# EAGLE schematic Cmde moteurs_5 (EAGLE 6.5.0)

## Sheet 1 of 3
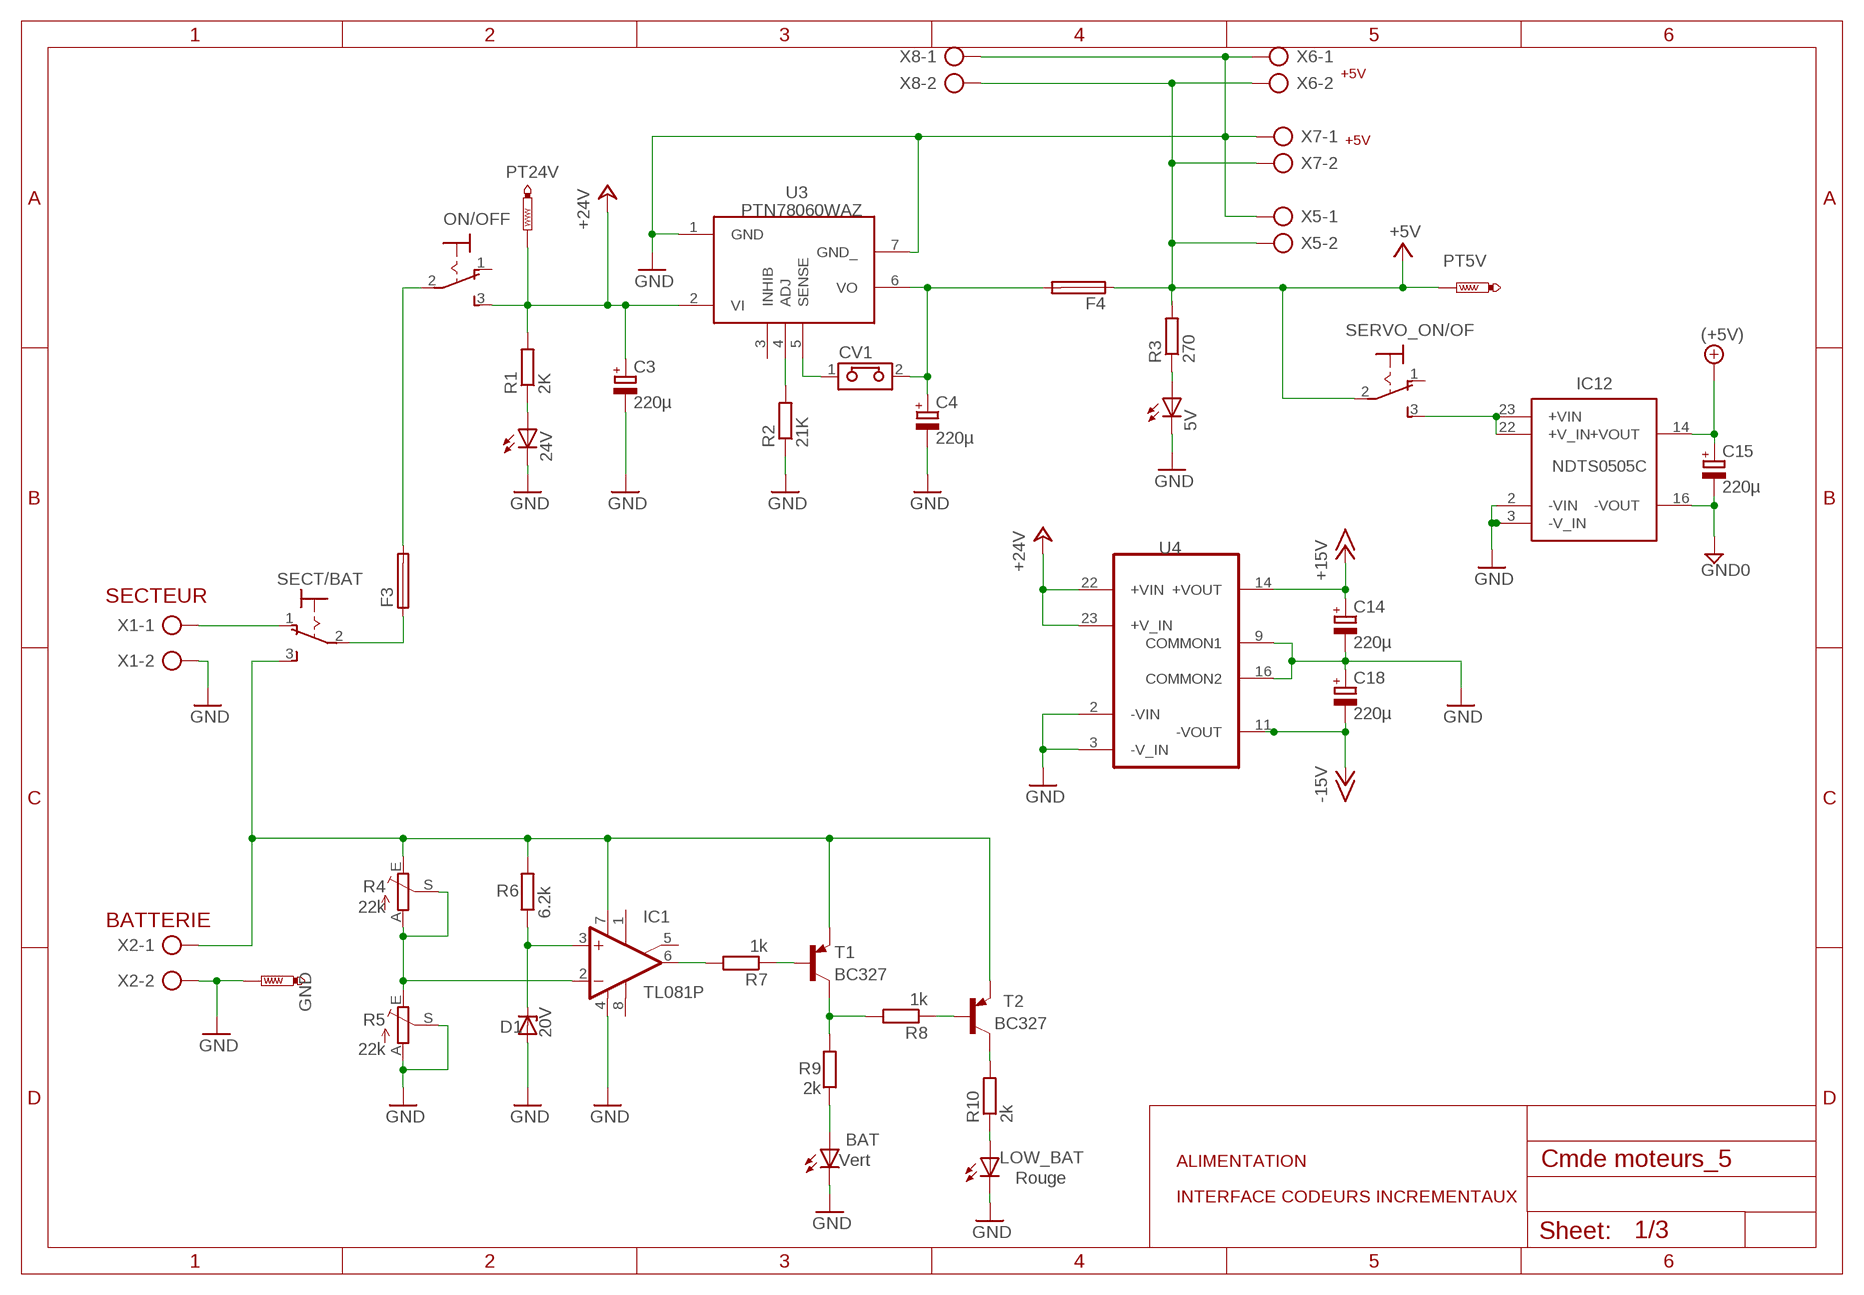
[diagram p0: schematic, sheet 1]

### Parts
5V  LED3MM  [LED3MM]
24V  LED3MM  [LED3MM]
BAT  Vert  LED3MM  [LED3MM]
C3  220µ  CPOL-EUE5-10.5  [E5-10,5]
C4  220µ  CPOL-EUE5-10.5  [E5-10,5]
C14  220µ  CPOL-EUE5-8.5  [E5-8,5]
C15  220µ  CPOL-EUE5-8.5  [E5-8,5]
C18  220µ  CPOL-EUE5-8.5  [E5-8,5]
CV1  CAVALIER  [CAVALIER]
D1  20V  BZX90  [DO34Z7]
F3  SH22,5  [SH22,5]
F4  SH22,5  [SH22,5]
GND  PTR1PAD1-13Y  [P1-13Y]
IC1  TL081P  [DIL08]
IC12  NDTS0505C  [NDTS05505]
LOW_BAT  Rouge  LED3MM  [LED3MM]
ON/OFF  320-916  [320-916]
PT5V  PTR1PAD1-13Y  [P1-13Y]
PT24V  PTR1PAD1-13Y  [P1-13Y]
R1  2K  R-EU_0207/10  [0207/10]
R2  21K  R-EU_0207/10  [0207/10]
R3  270  R-EU_0207/10  [0207/10]
R4  22k  TRIM_EU-B64Y  [B64Y]
R5  22k  TRIM_EU-B64Y  [B64Y]
R6  6.2k  R-EU_0207/10  [0207/10]
R7  1k  R-EU_0207/10  [0207/10]
R8  1k  R-EU_0207/10  [0207/10]
R9  2k  R-EU_0207/10  [0207/10]
R10  2k  R-EU_0207/10  [0207/10]
SECT/BAT  320-916  [320-916]
SERVO_ON/OF  320-916  [320-916]
T1  BC327  BC327-16-PNP-TO92-EBC  [TO92-EBC]
T2  BC327  BC327-16-PNP-TO92-EBC  [TO92-EBC]
U3  PTN78060WAD  [PTN78060]
U4  TEN8-2423  [NDTS05505]
X1  AK300/2  [AK300/2]
X2  AK300/2  [AK300/2]
X5  AK300/2  [AK300/2]
X6  AK300/2  [AK300/2]
X7  AK300/2  [AK300/2]
X8  AK300/2  [AK300/2]

### Nets
+5V: C15.+ F4.1 IC12.14(+VOUT) PT5V.TP R3.2 SERVO_ON/OF.2(P) X5.2 X6.2 X7.2 X8.2 ; supply symbol labelled (+5V) ; also sheet 2,3
+15V: C14.+ U4.14(+VOUT) ; also sheet 3
+24V: C3.+ ON/OFF.3(S) PT24V.TP R1.2 U3.2(VI) U4.22(+VIN) U4.23(+V_IN) ; also sheet 3
-15V: C18.- U4.11(-VOUT) ; also sheet 3
GND: 5V.K(C) 24V.K(C) BAT.K(C) C3.- C4.- C14.- C15.- C18.+ D1.A GND.TP IC1.4(V-) IC12.2(-VIN) IC12.3(-V_IN) IC12.16(-VOUT) LOW_BAT.K(C) R2.1 R5.A R5.S U3.1(GND) U3.7(GND_) U4.2(-VIN) U4.3(-V_IN) U4.9(COMMON1) U4.16(COMMON2) X1.2 X2.2 X5.1 X6.1 X7.1 X8.1 ; supply symbol labelled GND0 ; also sheet 2,3
N$4: IC1.7(V+) R4.E R6.2 SECT/BAT.3(S) T1.E T2.E X2.1
N$6: F3.1 SECT/BAT.2(P)
N$7: F3.2 ON/OFF.2(P)
N$9: R2.2 U3.4(ADJ)
N$10: 24V.A R1.1
N$12: 5V.A R3.1
N$13: CV1.1 U3.5(SENSE)
N$15: D1.C IC1.3(+IN) R6.1
N$16: IC1.2(-IN) R4.A R4.S R5.E
N$19: IC1.6(OUT) R7.2
N$21: R7.1 T1.B
N$23: R8.1 T2.B
N$24: R8.2 R9.2 T1.C
N$25: BAT.A R9.1
N$26: LOW_BAT.A R10.1
N$27: R10.2 T2.C
N$65: IC12.22(+V_IN) IC12.23(+VIN) SERVO_ON/OF.3(S)
N$187: C4.+ CV1.2 F4.2 U3.6(VO)
N$219: SECT/BAT.1(O) X1.1
Unconnected: IC1.1(ON1) IC1.5(ON2) IC1.8(OPT) ON/OFF.1(O) SERVO_ON/OF.1(O) U3.3(INHIB)

### Notes on the sheet
- +5V
- +5V
- PTN78060WAZ
- SECTEUR
- BATTERIE
- ALIMENTATION
- INTERFACE CODEURS INCREMENTAUX

## Sheet 2 of 3
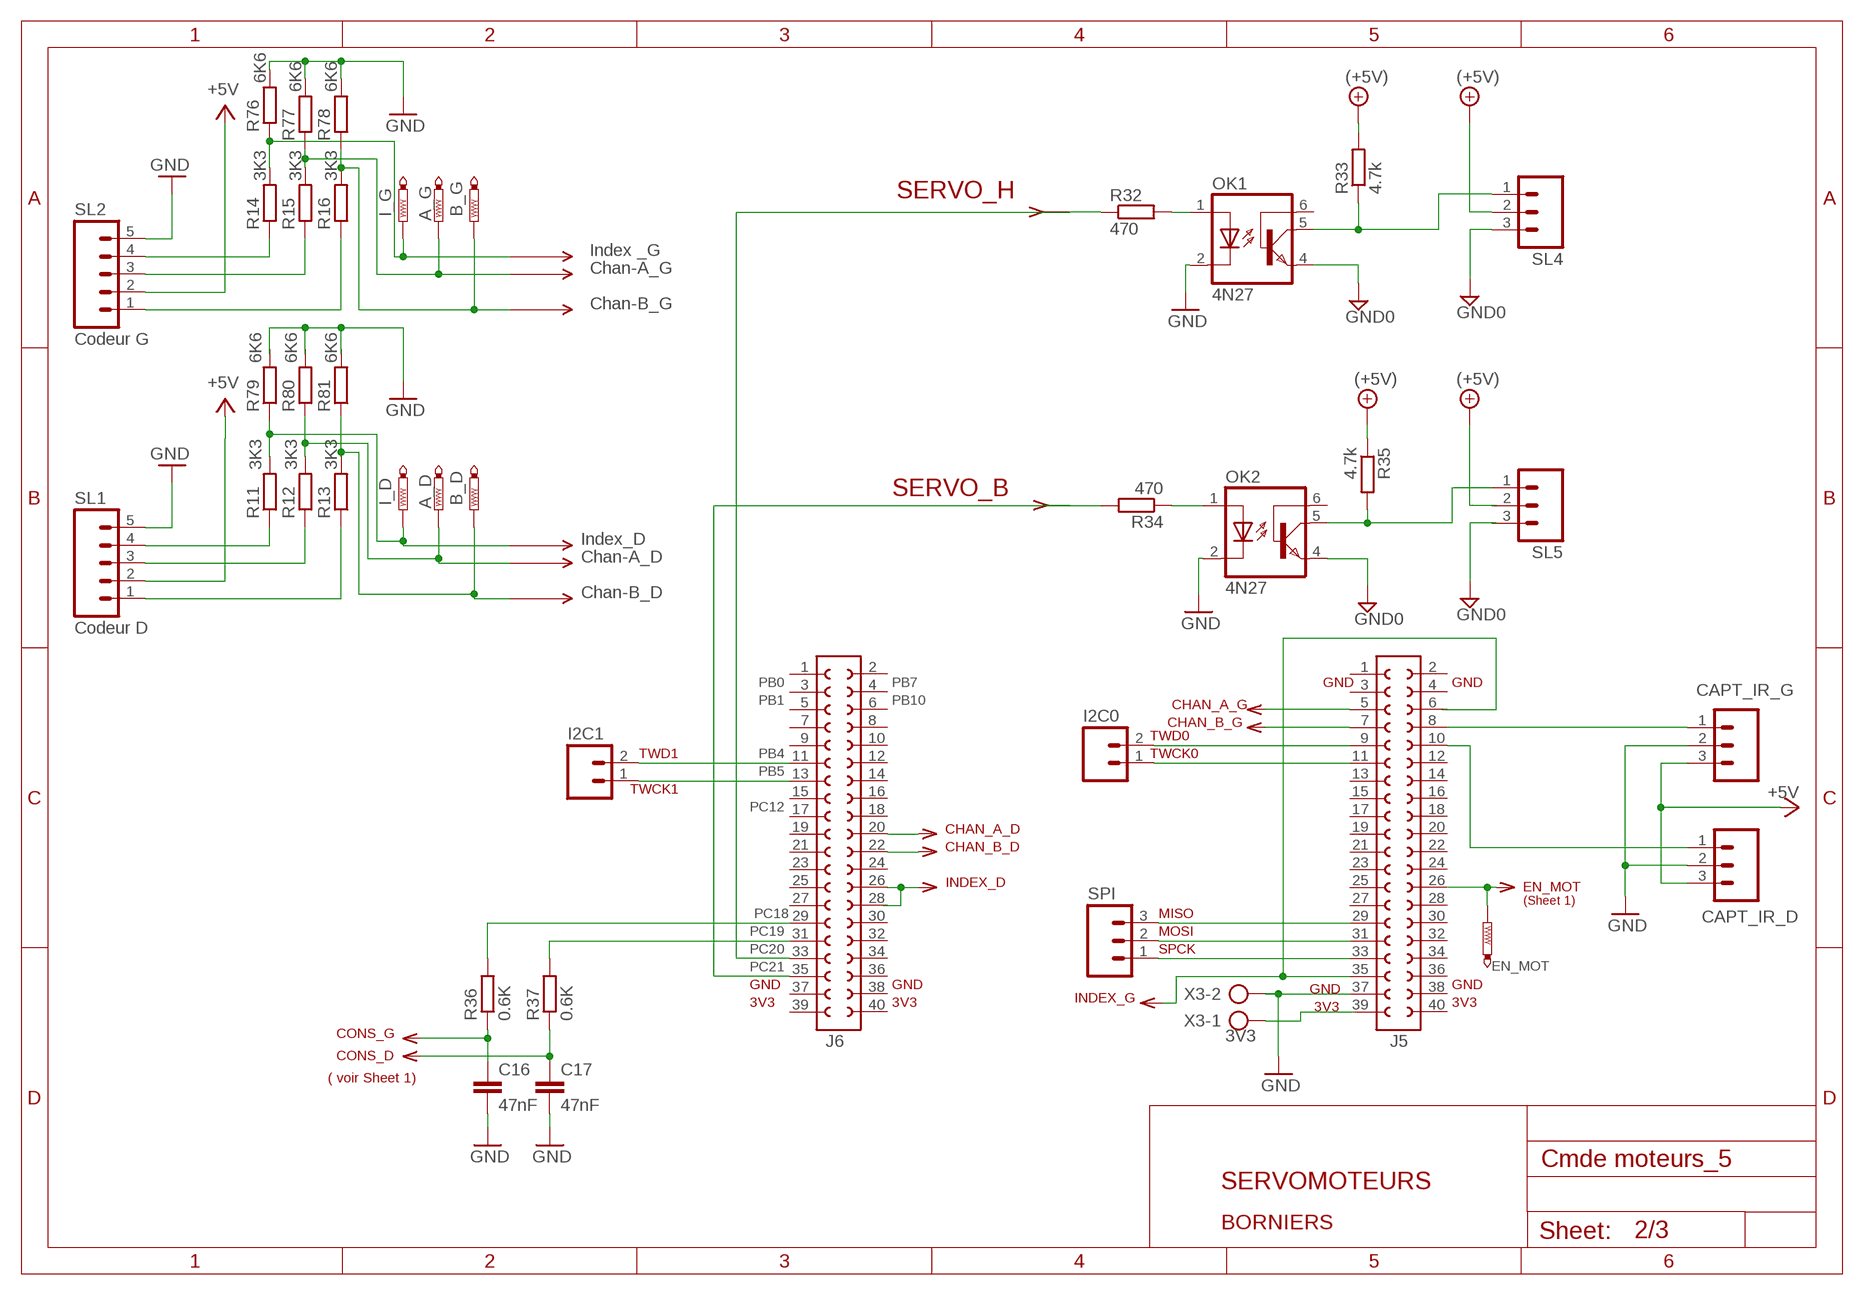
[diagram p1: schematic, sheet 2]

### Parts
A_D  PTR1PAD1-13Y  [P1-13Y]
A_G  PTR1PAD1-13Y  [P1-13Y]
B_D  PTR1PAD1-13Y  [P1-13Y]
B_G  PTR1PAD1-13Y  [P1-13Y]
C16  47nF  C-EU050-025X075  [C050-025X075]
C17  47nF  C-EU050-025X075  [C050-025X075]
CAPT_IR_D  M03  [03P]
CAPT_IR_G  M03  [03P]
EN_MOT  PTR1PAD1-13Y  [P1-13Y]
I2C0  M02  [02P]
I2C1  M02  [02P]
I_D  PTR1PAD1-13Y  [P1-13Y]
I_G  PTR1PAD1-13Y  [P1-13Y]
J5  CON_FE20-2_ROBOT  [CON_FE20-2]
J6  CON_FE20-2_ROBOT  [CON_FE20-2]
OK1  4N27  4N37  [DIL06]
OK2  4N27  4N37  [DIL06]
R11  3K3  R-EU_0207/10  [0207/10]
R12  3K3  R-EU_0207/10  [0207/10]
R13  3K3  R-EU_0207/10  [0207/10]
R14  3K3  R-EU_0207/10  [0207/10]
R15  3K3  R-EU_0207/10  [0207/10]
R16  3K3  R-EU_0207/10  [0207/10]
R32  470  R-EU_0207/10  [0207/10]
R33  4.7k  R-EU_0207/10  [0207/10]
R34  470  R-EU_0207/10  [0207/10]
R35  4.7k  R-EU_0207/10  [0207/10]
R36  0.6K  R-EU_0207/10  [0207/10]
R37  0.6K  R-EU_0207/10  [0207/10]
R76  6K6  R-EU_0207/10  [0207/10]
R77  6K6  R-EU_0207/10  [0207/10]
R78  6K6  R-EU_0207/10  [0207/10]
R79  6K6  R-EU_0207/10  [0207/10]
R80  6K6  R-EU_0207/10  [0207/10]
R81  6K6  R-EU_0207/10  [0207/10]
SL1  Codeur D  M05  [05P]
SL2  Codeur G  M05  [05P]
SL4  M03  [03P]
SL5  M03  [03P]
SPI  M03  [03P]
X3  3V3  AK300/2  [AK300/2]

### Nets
+5V: CAPT_IR_D.3 CAPT_IR_G.3 R33.2 R35.1 SL1.2 SL2.2 SL4.2 ; supply symbol labelled (+5V) ; also sheet 1,3
GND: C16.2 C17.2 CAPT_IR_D.2 CAPT_IR_G.2 J5.37 OK1.2(C) OK1.4(EMI) OK2.2(C) OK2.4(EMI) R76.2 R77.2 R78.2 R79.2 R80.2 R81.2 SL1.5 SL2.5 SL4.3 SL5.3 X3.2 ; supply symbol labelled GND0 ; also sheet 1,3
N$14: R11.1 SL1.4
N$17: R12.1 SL1.3
N$18: R13.1 SL1.1
N$20: R14.1 SL2.4
N$22: R15.1 SL2.3
N$31: R16.1 SL2.1
N$63: OK1.1(A) R32.2
N$66: OK1.5(COL) R33.1 SL4.1
N$68: OK2.5(COL) R35.2 SL5.1
N$69: OK2.1(A) R34.1
N$70: I2C0.2 J5.9
N$71: I2C0.1 J5.11
N$72: J6.29 R36.2
N$73: J6.31 R37.2
N$74: C17.1 R37.1
N$75: C16.1 R36.1
N$76: J6.33 R32.1
N$77: J6.35 R34.2
N$78: J5.35
N$79: I2C1.2 J6.11
N$80: I2C1.1 J6.13
N$81: J5.33 SPI.1
N$82: J5.31 SPI.2
N$83: J5.29 SPI.3
N$84: J5.7
N$85: J5.5
N$86: CAPT_IR_G.1 J5.8
N$87: CAPT_IR_D.1 J5.10
N$88: EN_MOT.TP J5.26
N$89: J6.20
N$90: J6.22
N$91: J6.26
N$173: X3.1
N$879: B_D.TP R13.2 R81.1
N$881: B_G.TP R16.2 R78.1
N$882: A_D.TP R12.2 R80.1
N$885: I_G.TP R14.2 R76.1
N$886: A_G.TP R15.2 R77.1
N$888: I_D.TP R11.2 R79.1
Unconnected: J5.1 J5.2 J5.3 J5.4 J5.6 J5.12 J5.13 J5.14 J5.15 J5.16 J5.17 J5.18 J5.19 J5.20 J5.21 J5.22 J5.23 J5.24 J5.25 J5.27 J5.28 J5.30 J5.32 J5.34 J5.36 J5.38 J5.39 J5.40 J6.1 J6.2 J6.3 J6.4 J6.5 J6.6 J6.7 J6.8 J6.9 J6.10 J6.12 J6.14 J6.15 J6.16 J6.17 J6.18 J6.19 J6.21 J6.23 J6.24 J6.25 J6.27 J6.28 J6.30 J6.32 J6.34 J6.36 J6.37 J6.38 J6.39 J6.40 OK1.6(BAS) OK2.6(BAS) SL5.2

### Notes on the sheet
- SERVO_H
- Index _G
- Chan-A_G
- Chan-B_G
- SERVO_B
- Index_D
- Chan-A_D
- Chan-B_D
- PB0 | PB7 | GND | GND
- PB1 | PB10
- CHAN_A_G
- CHAN_B_G
- TWD0
- TWD1 | PB4 | TWCK0
- PB5
- TWCK1
- PC12
- CHAN_A_D
- CHAN_B_D
- INDEX_D
- EN_MOT
- (Sheet 1)
- PC18 | MISO
- PC19 | MOSI
- PC20 | SPCK
- PC21
- GND | GND | GND
- GND
- INDEX_G
- 3V3 | 3V3 | 3V3
- 3V3
- CONS_G
- CONS_D
- ( voir Sheet 1)
- SERVOMOTEURS
- BORNIERS

## Sheet 3 of 3
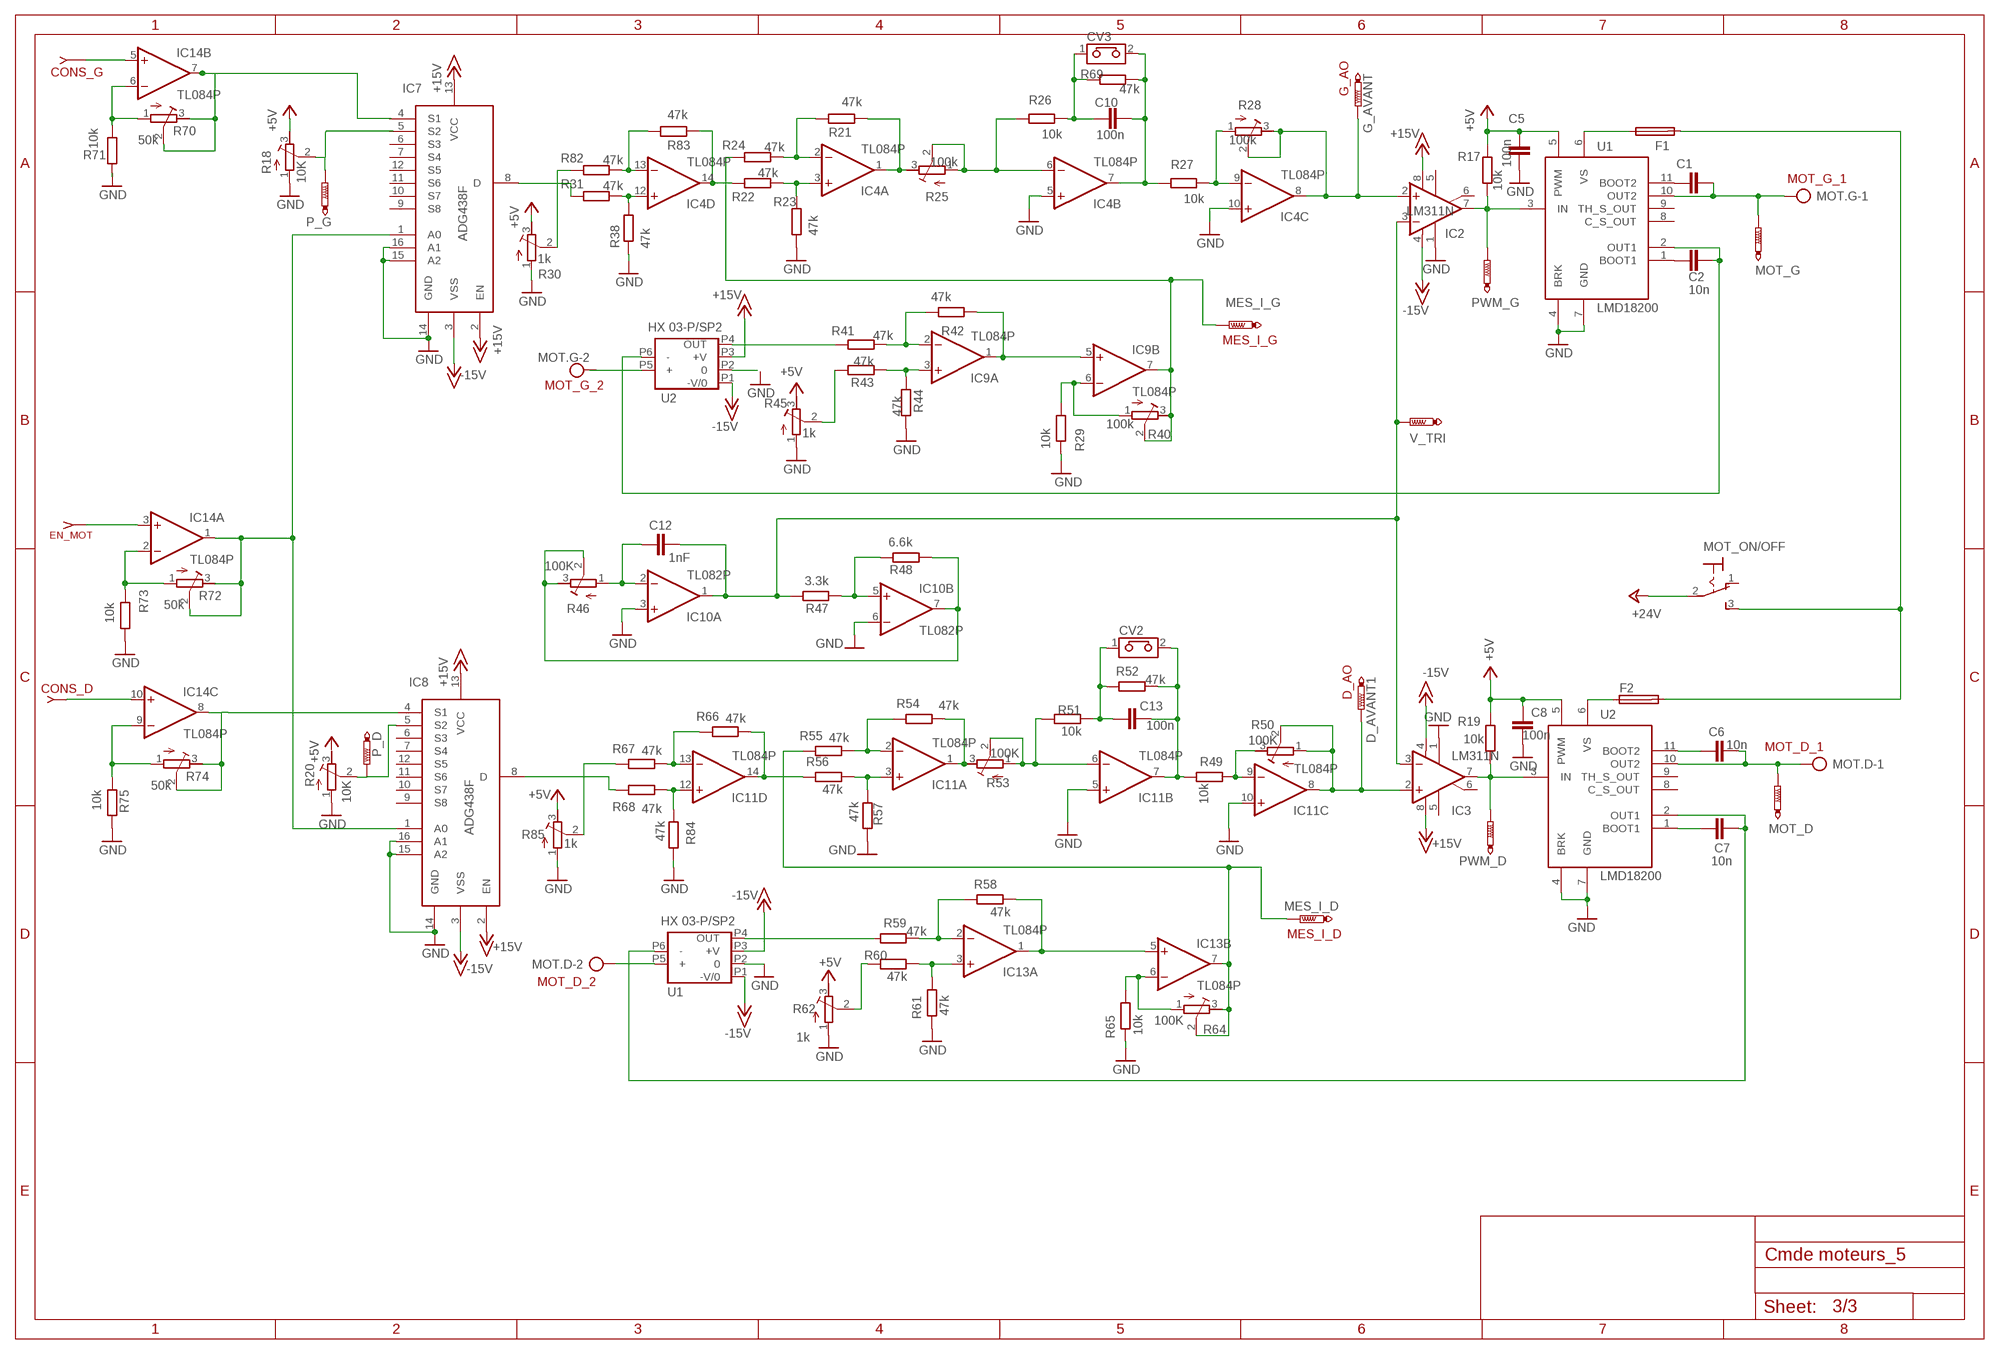
[diagram p2: schematic, sheet 3]

### Parts
C1  10n  C-EU050-025X075  [C050-025X075]
C2  10n  C-EU050-025X075  [C050-025X075]
C5  100n  C-EU050-025X075  [C050-025X075]
C6  10n  C-EU050-025X075  [C050-025X075]
C7  10n  C-EU050-025X075  [C050-025X075]
C8  100n  C-EU050-025X075  [C050-025X075]
C10  100n  C-EU050-025X075  [C050-025X075]
C12  1nF  C-EU050-025X075  [C050-025X075]
C13  100n  C-EU050-025X075  [C050-025X075]
CV2  CAVALIER  [CAVALIER]
CV3  CAVALIER  [CAVALIER]
D_AVANT1  PTR1PAD1-13Y  [P1-13Y]
F1  SH22,5  [SH22,5]
F2  SH22,5  [SH22,5]
G_AVANT  PTR1PAD1-13Y  [P1-13Y]
IC2  LM311N  [DIL08]
IC3  LM311N  [DIL08]
IC4  TL084P  [DIL14]
IC7  ADG438F  [DIL16]
IC8  ADG438F  [DIL16]
IC9  TL084P  [DIL14]
IC10  TL082P  [DIL08]
IC11  TL084P  [DIL14]
IC13  TL084P  [DIL14]
IC14  TL084P  [DIL14]
MES_I_D  PTR1PAD1-13Y  [P1-13Y]
MES_I_G  PTR1PAD1-13Y  [P1-13Y]
MOT.D  AK300/2  [AK300/2]
MOT.G  AK300/2  [AK300/2]
MOT_D  PTR1PAD1-13Y  [P1-13Y]
MOT_G  PTR1PAD1-13Y  [P1-13Y]
MOT_ON/OFF  320-916  [320-916]
P_D  PTR1PAD1-13Y  [P1-13Y]
P_G  PTR1PAD1-13Y  [P1-13Y]
PWM_D  PTR1PAD1-13Y  [P1-13Y]
PWM_G  PTR1PAD1-13Y  [P1-13Y]
R17  10k  R-EU_0207/10  [0207/10]
R18  10K  R-TRIMM3296W  [RTRIM3296W]
R19  10k  R-EU_0207/10  [0207/10]
R20  10K  R-TRIMM3296W  [RTRIM3296W]
R21  47k  R-EU_0207/10  [0207/10]
R22  47k  R-EU_0207/10  [0207/10]
R23  47k  R-EU_0207/10  [0207/10]
R24  47k  R-EU_0207/10  [0207/10]
R25  100k  R-TRIMM3296W  [RTRIM3296W]
R26  10k  R-EU_0207/10  [0207/10]
R27  10k  R-EU_0207/10  [0207/10]
R28  100k  R-TRIMM3296W  [RTRIM3296W]
R29  10k  R-EU_0207/10  [0207/10]
R30  1k  R-TRIMM3296W  [RTRIM3296W]
R31  47k  R-EU_0207/10  [0207/10]
R38  47k  R-EU_0207/10  [0207/10]
R40  100k  R-TRIMM3296W  [RTRIM3296W]
R41  47k  R-EU_0207/10  [0207/10]
R42  47k  R-EU_0207/10  [0207/10]
R43  47k  R-EU_0207/10  [0207/10]
R44  47k  R-EU_0207/10  [0207/10]
R45  1k  R-TRIMM3296W  [RTRIM3296W]
R46  100K  R-TRIMM3296W  [RTRIM3296W]
R47  3.3k  R-EU_0207/10  [0207/10]
R48  6.6k  R-EU_0207/10  [0207/10]
R49  10k  R-EU_0207/10  [0207/10]
R50  100K  R-TRIMM3296W  [RTRIM3296W]
R51  10k  R-EU_0207/10  [0207/10]
R52  47k  R-EU_0207/10  [0207/10]
R53  100K  R-TRIMM3296W  [RTRIM3296W]
R54  47k  R-EU_0207/10  [0207/10]
R55  47k  R-EU_0207/10  [0207/10]
R56  47k  R-EU_0207/10  [0207/10]
R57  47k  R-EU_0207/10  [0207/10]
R58  47k  R-EU_0207/10  [0207/10]
R59  47k  R-EU_0207/10  [0207/10]
R60  47k  R-EU_0207/10  [0207/10]
R61  47k  R-EU_0207/10  [0207/10]
R62  1k  R-TRIMM3296W  [RTRIM3296W]
R64  100K  R-TRIMM3296W  [RTRIM3296W]
R65  10k  R-EU_0207/10  [0207/10]
R66  47k  R-EU_0207/10  [0207/10]
R67  47k  R-EU_0207/10  [0207/10]
R68  47k  R-EU_0207/10  [0207/10]
R69  47k  R-EU_0207/10  [0207/10]
R70  50k  R-TRIMM3296W  [RTRIM3296W]
R71  10k  R-EU_0207/10  [0207/10]
R72  50k  R-TRIMM3296W  [RTRIM3296W]
R73  10k  R-EU_0207/10  [0207/10]
R74  50k  R-TRIMM3296W  [RTRIM3296W]
R75  10k  R-EU_0207/10  [0207/10]
R82  47k  R-EU_0207/10  [0207/10]
R83  47k  R-EU_0207/10  [0207/10]
R84  47k  R-EU_0207/10  [0207/10]
R85  1k  R-TRIMM3296W  [RTRIM3296W]
U1  LMD18200  [MULTIWATT_11]
U2  LMD18200  [MULTIWATT_11]
U$1  HX03  [HX03]
U$2  HX03  [HX03]
V_TRI  V_TRI  PTR1PAD1-13Y  [P1-13Y]

### Nets
+5V: C5.2 C8.2 R17.2 R18.3(E) R19.2 R30.3(E) R45.3(E) R62.3(E) R85.3(E) U1.5(PWM) U2.5(PWM) ; also sheet 1,2
+15V: IC2.8(V+) IC3.8(V+) IC7.2(EN) IC7.13(VCC) IC8.2(EN) IC8.13(VCC) U$2.P3(+V) ; also sheet 1
+24V: MOT_ON/OFF.2(P) ; also sheet 1
-15V: IC2.4(V-) IC3.4(V-) IC7.3(VSS) IC8.3(VSS) U$1.P1(-V/0) U$1.P3(+V) U$2.P1(-V/0) ; also sheet 1
GND: C5.1 C8.1 IC2.1(GND) IC3.1(GND) IC4.5(B:+IN) IC4.10(C:+IN) IC7.14(GND) IC7.15(A2) IC7.16(A1) IC8.14(GND) IC8.15(A2) IC8.16(A1) IC10.3(A:+IN) IC10.6(B:-IN) IC11.5(B:+IN) IC11.10(C:+IN) R18.1(A) R20.1(A) R23.1 R29.1 R38.1 R44.1 R45.1(A) R57.2 R61.2 R62.1(A) R65.2 R71.1 R73.1 R75.1 R84.2 R85.1(A) U1.4(BRK) U1.7(GND) U2.4(BRK) U2.7(GND) U$1.P2 ; also sheet 1,2
N$1: F1.1 U1.6(VS)
N$2: C1.1 U1.11(BOOT2)
N$3: C1.2 MOT.G.1 MOT_G.TP U1.10(OUT2)
N$5: IC14.7(B:OUT) R70.2(S) R70.3(E)
N$11: IC11.1(A:OUT) R53.3(E) R54.1
N$28: IC7.8(D) R31.2
N$29: IC2.7(OUT) PWM_G.TP R17.1 U1.3(IN)
N$30: IC4.3(A:+IN) R22.1 R23.2
N$33: C2.2 U1.1(BOOT1)
N$34: U$1.P4(OUT)
N$35: F2.1 U2.6(VS)
N$36: C6.1 U2.11(BOOT2)
N$37: C6.2 MOT.D.1 MOT_D.TP U2.10(OUT2)
N$38: IC3.7(OUT) PWM_D.TP R19.1 U2.3(IN)
N$39: C13.2 CV2.1 R51.1 R52.2
N$41: P_D.TP R20.2(S)
N$42: C7.2 U2.1(BOOT1)
N$43: IC14.6(B:-IN) R70.1(A) R71.2
N$44: F1.2 F2.2 MOT_ON/OFF.3(S)
N$45: IC14.8(C:OUT) R74.2(S) R74.3(E)
N$46: C7.1 U2.2(OUT1) U$1.P6(-)
N$47: MOT.D.2 U$1.P5(+)
N$48: IC4.1(A:OUT) R21.1 R25.3(E)
N$50: IC13.1(A:OUT) IC13.5(B:+IN) R58.1
N$51: IC4.2(A:-IN) R21.2 R24.1
N$52: IC4.6(B:-IN) R25.1(A) R25.2(S) R26.2
N$53: C10.1 CV3.1 R26.1 R69.2
N$54: C13.1 CV2.2 IC11.7(B:OUT) R49.2 R52.1
N$55: C10.2 CV3.2 IC4.7(B:OUT) R27.2 R69.1
N$56: IC4.9(C:-IN) R27.1 R28.1(A)
N$57: R41.1 U$2.P4(OUT)
N$59: IC11.9(C:-IN) R49.1 R50.3(E)
N$60: G_AVANT.TP IC2.2(+IN) IC4.8(C:OUT) R28.2(S) R28.3(E)
N$61: IC9.6(B:-IN) R29.2 R40.1(A)
N$62: IC9.3(A:+IN) R43.2 R44.2
N$64: IC9.2(A:-IN) R41.2 R42.1
N$67: C2.1 U1.2(OUT1) U$2.P6(-)
N$92: D_AVANT1.TP IC3.2(+IN) IC11.8(C:OUT) R50.1(A) R50.2(S)
N$93: IC11.6(B:-IN) R51.2 R53.1(A) R53.2(S)
N$108: P_G.TP R18.2(S)
N$135: R43.1 R45.2(S)
N$136: IC9.7(B:OUT) MES_I_G.TP R24.2 R40.2(S) R40.3(E)
N$138: IC4.13(D:-IN) R82.1 R83.2
N$139: R30.2(S) R82.2
N$140: IC11.14(D:OUT) R56.2 R66.1
N$141: IC4.12(D:+IN) R31.1 R38.2
N$142: R60.2 R62.2(S)
N$143: IC13.6(B:-IN) R64.1(A) R65.1
N$144: IC13.7(B:OUT) MES_I_D.TP R55.2 R64.2(S) R64.3(E)
N$145: IC4.14(D:OUT) R22.2 R83.1
N$146: IC11.13(D:-IN) R66.2 R67.1
N$147: IC11.12(D:+IN) R68.1 R84.1
N$148: R67.2 R85.2(S)
N$150: IC8.8(D) R68.2
N$179: U$2.P2
N$277: U$2.P5(+)
N$726: IC9.1(A:OUT) IC9.5(B:+IN) R42.2
N$727: C12.2 IC10.2(A:-IN) R46.1(A)
N$730: C12.1 IC2.3(-IN) IC3.3(-IN) IC10.1(A:OUT) R47.1 V_TRI.TP
N$734: IC10.5(B:+IN) R47.2 R48.1
N$735: IC10.7(B:OUT) R46.2(S) R46.3(E) R48.2
N$736: IC11.3(A:+IN) R56.1 R57.1
N$737: IC11.2(A:-IN) R54.2 R55.1
N$738: IC13.3(A:+IN) R60.1 R61.1
N$739: IC13.2(A:-IN) R58.2 R59.1
N$743: IC14.5(B:+IN)
N$747: IC14.3(A:+IN)
N$748: IC14.2(A:-IN) R72.1(A) R73.2
N$749: IC14.9(C:-IN) R74.1(A) R75.2
N$750: IC7.1(A0) IC8.1(A0) IC14.1(A:OUT) R72.2(S) R72.3(E)
N$752: IC14.10(C:+IN)
Unconnected: IC2.5(ON) IC2.6(ON/STR) IC3.5(ON) IC3.6(ON/STR) IC7.4(S1) IC7.5(S2) IC7.6(S3) IC7.7(S4) IC7.9(S8) IC7.10(S7) IC7.11(S6) IC7.12(S5) IC8.4(S1) IC8.5(S2) IC8.6(S3) IC8.7(S4) IC8.9(S8) IC8.10(S7) IC8.11(S6) IC8.12(S5) IC9.8(C:OUT) IC9.9(C:-IN) IC9.10(C:+IN) IC9.12(D:+IN) IC9.13(D:-IN) IC9.14(D:OUT) IC13.8(C:OUT) IC13.9(C:-IN) IC13.10(C:+IN) IC13.12(D:+IN) IC13.13(D:-IN) IC13.14(D:OUT) IC14.12(D:+IN) IC14.13(D:-IN) IC14.14(D:OUT) MOT.G.2 MOT_ON/OFF.1(O) R20.3(E) R30.1(A) R59.2 U1.8(C_S_OUT) U1.9(TH_S_OUT) U2.8(C_S_OUT) U2.9(TH_S_OUT)

### Notes on the sheet
- CONS_G
- G_AO
- MOT_G_1
- HX 03-P/SP2
- MES_I_G
- MOT_G_2
- U2
- EN_MOT
- CONS_D
- D_AO
- MOT_D_1
- HX 03-P/SP2
- MES_I_D
- MOT_D_2
- U1

## Power pins joined to a net without a drawn wire
V+: IC4.4(P:V+) IC9.4(P:V+) IC10.8(P:V+) IC11.4(P:V+) IC13.4(P:V+) IC14.4(P:V+)
V-: IC4.11(P:V-) IC9.11(P:V-) IC10.4(P:V-) IC11.11(P:V-) IC13.11(P:V-) IC14.11(P:V-)

## Library data of the parts
5V 24V BAT LOW_BAT = led:LED: LED OSRAM: - CHIPLED LG R971, LG N971, LY N971, LG Q971, LY Q971, LO R971, LY R971 LH N974, LH R974 LS Q976, LO Q976, LY Q976 LO Q996 - Hyper CHIPLED LW Q18S LB Q993, LB Q99A, LB R99A - SideLED LS A670, LO A670, LY A670, LG A670, LP A670 LB A673, LV A673, LT A673, LW A673 LH A674 LY A675 LS A676, LA A676, LO A676, LY A676, LW A676 LS A679, LY A679, LG A679 - Hyper Micro SIDELED® LS Y876, LA Y876, LO Y876, LY Y876 LT Y87S - SmartLED LW L88C, LW L88S LB L89C, LB L89S, LG L890 LS L89K, LO L89K, LY L89K LS L896, LA L896, LO L896, LY L896 - TOPLED LS T670, LO T670, LY T670, LG T670, LP T670 LSG T670, LSP T670, LSY T670, LOP T670, LYG T670 LG T671, LOG T671, LSG T671 LB T673, LV T673, LT T673, LW T673 LH T674 LS T676, LA T676, LO T676, LY T676, LB T676, LH T676, LSB T676, LW T676 LB T67C, LV T67C, LT T67C, LS T67K, LO T67K, LY T67K, LW E67C LS E67B, LA E67B, LO E67B, LY E67B, LB E67C, LV E67C, LT E67C LW T67C LS T679, LY T679, LG T679 LS T770, LO T770, LY T770, LG T770, LP T770 LB T773, LV T773, LT T773, LW T773 LH T774 LS E675, LA E675, LY E675, LS T675 LS T776, LA T776, LO T776, LY T776, LB T776 LHGB T686 LT T68C, LB T68C - Hyper Mini TOPLED® LB M676 - Mini TOPLED Santana® LG M470 LS M47K, LO M47K, LY M47K Source: http://www.osram.convergy.de LUXEON: - LUMILED® LXK2-PW12-R00, LXK2-PW12-S00, LXK2-PW14-U00, LXK2-PW14-V00 LXK2-PM12-R00, LXK2-PM12-S00, LXK2-PM14-U00 LXK2-PE12-Q00, LXK2-PE12-R00, LXK2-PE12-S00, LXK2-PE14-T00, LXK2-PE14-U00 LXK2-PB12-K00, LXK2-PB12-L00, LXK2-PB12-M00, LXK2-PB14-N00, LXK2-PB14-P00, LXK2-PB14-Q00 LXK2-PR12-L00, LXK2-PR12-M00, LXK2-PR14-Q00, LXK2-PR14-R00 LXK2-PD12-Q00, LXK2-PD12-R00, LXK2-PD12-S00 LXK2-PH12-R00, LXK2-PH12-S00 LXK2-PL12-P00, LXK2-PL12-Q00, LXK2-PL12-R00 Source: www.luxeon.com KINGBRIGHT: KA-3528ASYC Source: www.kingbright.com
A_D A_G B_D B_G D_AVANT1 EN_MOT G_AVANT GND I_D I_G MES_I_D MES_I_G MOT_D MOT_G P_D P_G PT5V PT24V PWM_D PWM_G V_TRI = testpad:PTR1: TEST PIN
C1 C2 C5-C8 C10 C12 C13 C16 C17 = rcl:C-EU: CAPACITOR, European symbol
C3 C4 C14 C15 C18 = rcl:CPOL-EU: POLARIZED CAPACITOR, European symbol
CAPT_IR_D CAPT_IR_G SL4 SL5 SPI = con-amp-quick:M03: AMP QUICK CONNECTOR; OC_FARNELL: unknown; OC_NEWARK: unknown
CV1-CV3 = JL_Composants:CAVALIER: Cavalier_2
D1 = diode:BZX90: Z DIODE
F1-F4 = fuse:SH22,5: FUSE HOLDER grid 22,5 mm, OGN0031 8201, Schurter (Buerklin); MF: SCHURTER; MPN: 0031.8201; OC_FARNELL: 1162740; OC_NEWARK: 96F8317
I2C0 I2C1 = con-amp-quick:M02: AMP QUICK CONNECTOR; OC_FARNELL: unknown; OC_NEWARK: unknown
IC1 = linear:TL081: OP AMP
IC2 IC3 = linear:LM311: COMPARATOR
IC4 IC9 IC11 IC13 IC14 = linear:TL084: OP AMP
IC7 IC8 = JL_Composants:ADG438F: ADG438 Analog Devices - High Performance 4/8 Channel Fault-Protected Analog Multiplexers
IC10 = linear:TL082: OP AMP
IC12 = JL_Composants:NDTS0505C: Isolated 3W Single Output DC/DC Converter
J5 J6 = JL_Composants:CON_FE20-2_ROBOT
MOT.D MOT.G X1-X3 X5-X8 = con-ptr500:AK300/2: CONNECTOR; OC_FARNELL: unknown; OC_NEWARK: unknown
MOT_ON/OFF ON/OFF SECT/BAT SERVO_ON/OF = switch:320-916: TOGGLE SWITCH distributor RS Components
OK1 OK2 = optocoupler:4N37: OPTO COUPLER Source: http://www.fairchildsemi.com/pf/4N/4N35-M.html; MF: FAIRCHILD SEMICONDUCTOR; MPN: 4N37; OC_FARNELL: 1612456; OC_NEWARK: 72K9948
R1-R3 R6-R17 R19 R21-R24 R26 R27 R29 R31-R38 R41-R44 R47-R49 R51 R52 R54-R61 R65-R69 R71 R73 R75-R84 = rcl:R-EU_: RESISTOR, European symbol
R4 R5 = pot:TRIM_EU-: POTENTIOMETER
R18 R20 R25 R28 R30 R40 R45 R46 R50 R53 R62 R64 R70 R72 R74 R85 = rcl:R-TRIMM: Trimm resistor
SL1 SL2 = con-amp-quick:M05: AMP QUICK CONNECTOR; OC_FARNELL: unknown; OC_NEWARK: unknown
T1 T2 = transistor:*-PNP-: PNP Transistror
U1 U2 = JL_Composants:LMD18200: LMD18200 3A, 55V H-Bridge
U3 = JL_Composants:PTN78060WAD: DC-DC NON ISOLATED
U4 = JL_Composants:TEN8-2423
U$1 U$2 = HX03_capteur:HX03; HX03: HX03